# Altium schematic sheet CRYO_ASIC_flex_40pin_adapter.SchDoc
size A3; SheetNumber: 1; SheetTotal: 1
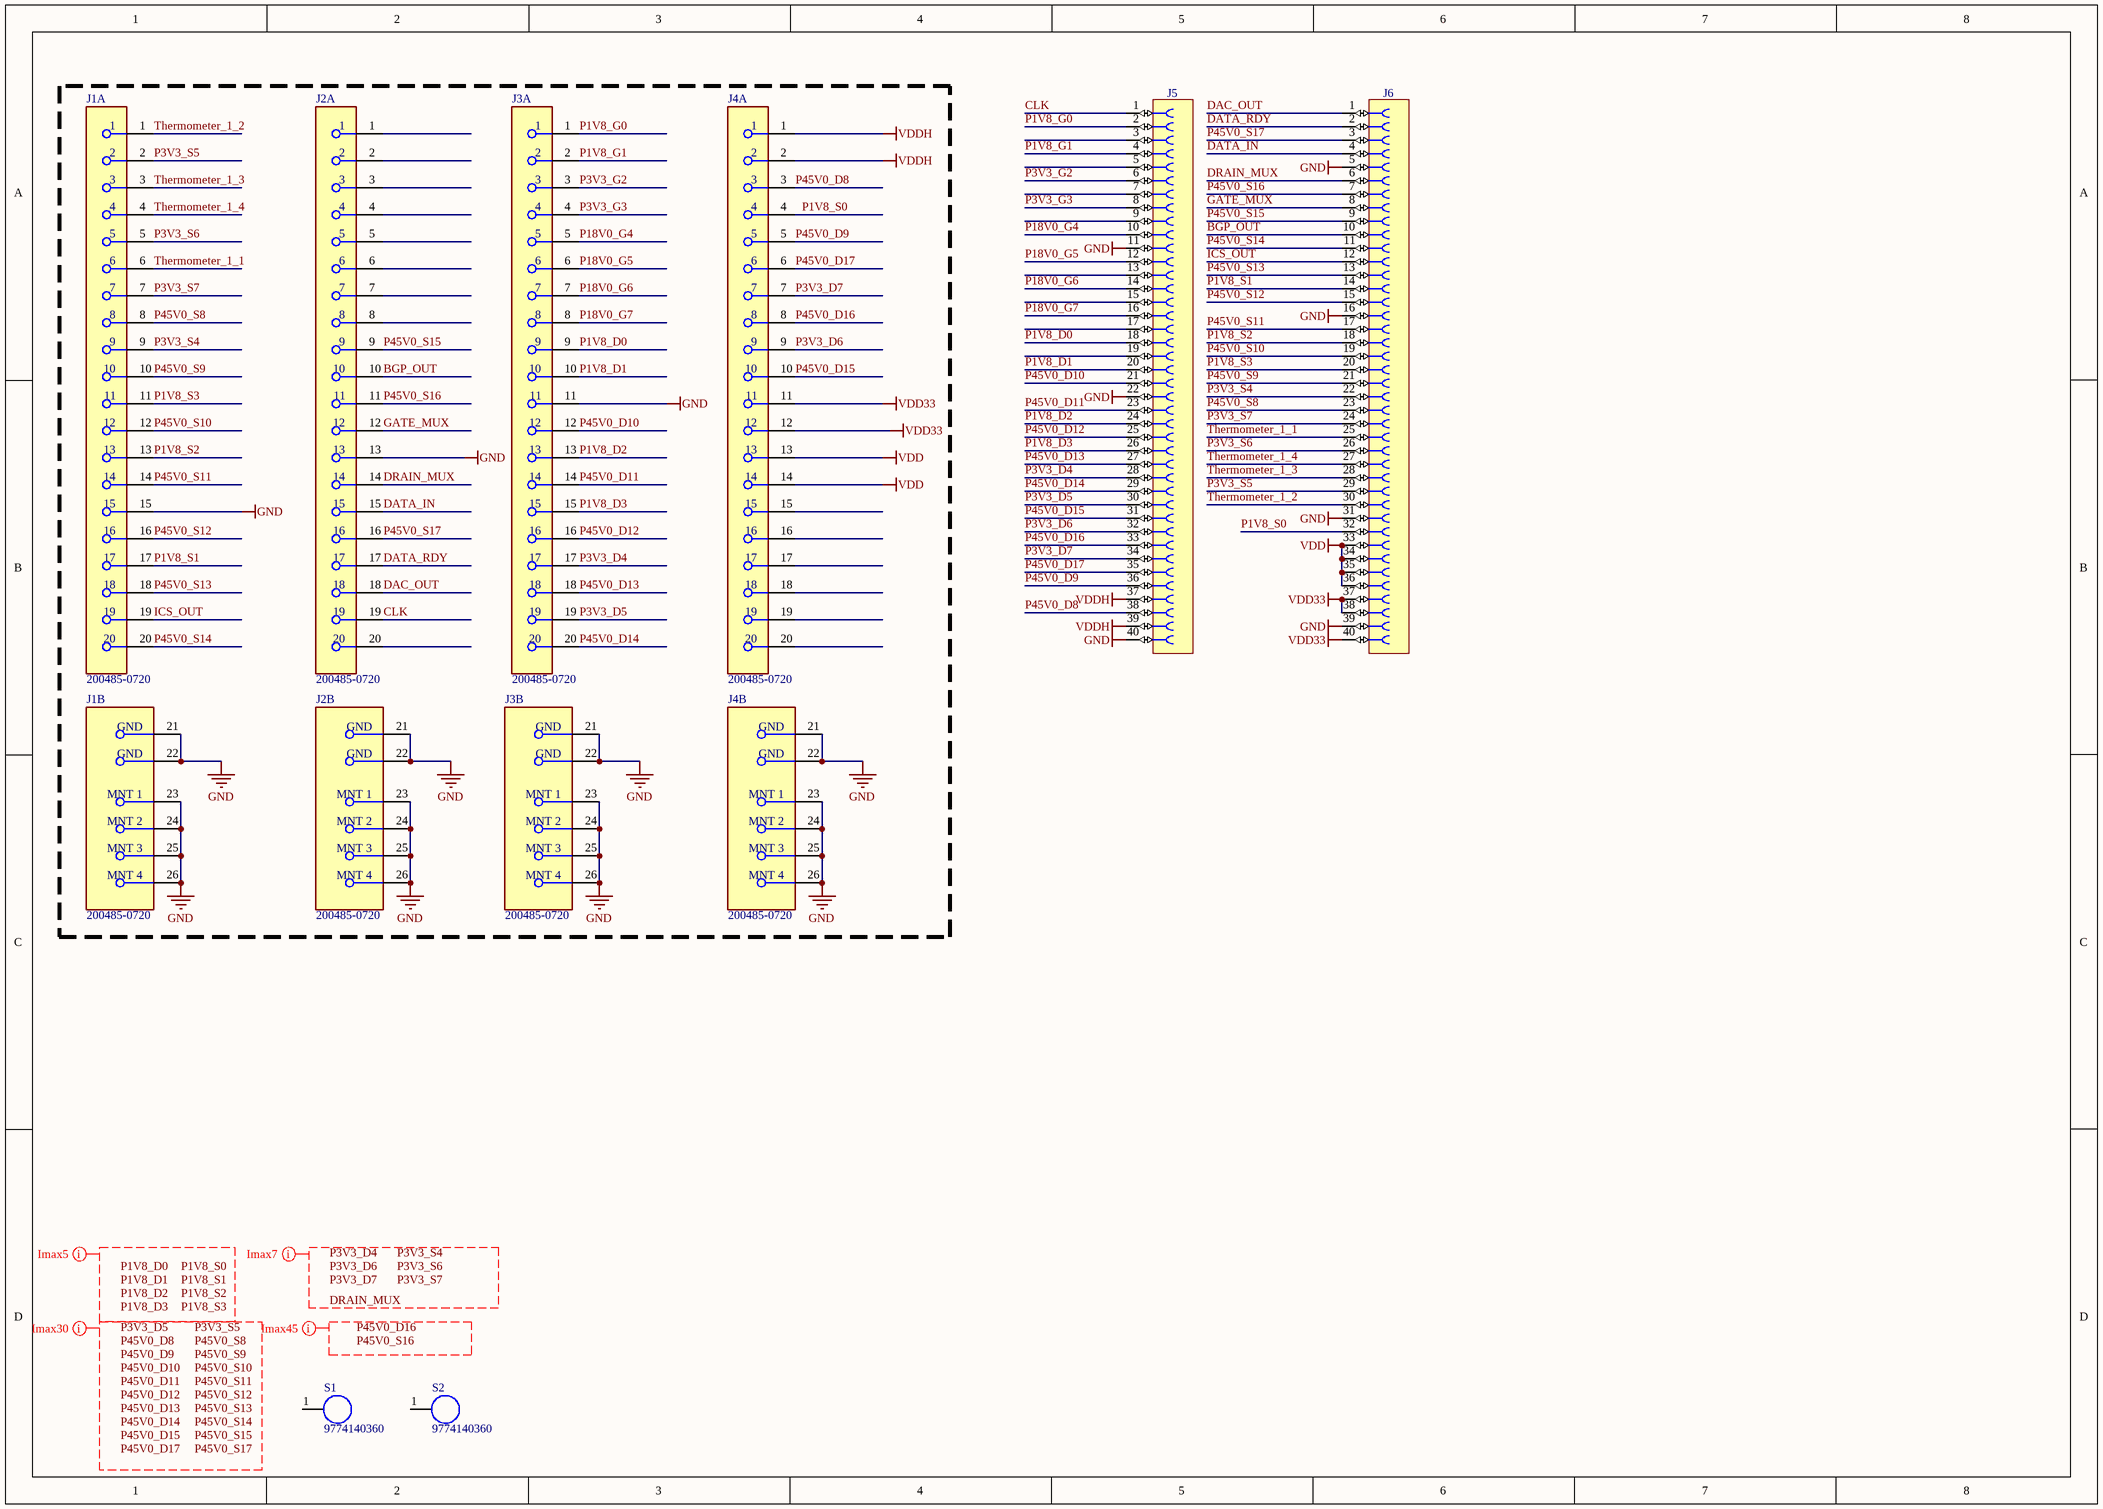
[diagram p0: CRYO_ASIC_flex_40pin_adapter.SchDoc]

## Parts
J1  200485-0720  [FP-200485-0720-MFG]  (parts A,B of 2)
J2  200485-0720  [FP-200485-0720-MFG]  (parts A,B of 2)
J3  200485-0720  [FP-200485-0720-MFG]  (parts A,B of 2)
J4  200485-0720  [FP-200485-0720-MFG]  (parts A,B of 2)
J5  Socket 40  [SAMTEC_RSM-120-02-L-D-K-TR]  (value not drawn)
J6  Socket 40  [SAMTEC_RSM-120-02-L-D-K-TR]  (value not drawn)
S1  9774140360  [9774140360]
S2  9774140360  [9774140360]

## Nets
GND: J1.15 J1.21(GND) J1.22(GND) J1.23(MNT_1) J1.24(MNT_2) J1.25(MNT_3) J1.26(MNT_4) J2.13 J2.21(GND) J2.22(GND) J2.23(MNT_1) J2.24(MNT_2) J2.25(MNT_3) J2.26(MNT_4) J3.11 J3.21(GND) J3.22(GND) J3.23(MNT_1) J3.24(MNT_2) J3.25(MNT_3) J3.26(MNT_4) J4.21(GND) J4.22(GND) J4.23(MNT_1) J4.24(MNT_2) J4.25(MNT_3) J4.26(MNT_4) J5.11 J5.22 J5.40 J6.5 J6.16 J6.31 J6.39
VDD: J4.13 J4.14 J6.33 J6.34 J6.35 J6.36
VDD33: J4.11 J4.12 J6.37 J6.38 J6.40
VDDH: J4.1 J4.2 J5.37 J5.39
BGP_OUT: J2.10 J6.10
CLK: J2.19 J5.1
DAC_OUT: J2.18 J6.1
DATA_IN: J2.15 J6.4
DATA_RDY: J2.17 J6.2
DRAIN_MUX: J2.14 J6.6
GATE_MUX: J2.12 J6.8
ICS_OUT: J1.19 J6.12
P1V8_D0: J3.9 J5.18
P1V8_D1: J3.10 J5.20
P1V8_D2: J3.13 J5.24
P1V8_D3: J3.15 J5.26
P1V8_G0: J3.1 J5.2
P1V8_G1: J3.2 J5.4
P1V8_S0: J4.4 J6.32
P1V8_S1: J1.17 J6.14
P1V8_S2: J1.13 J6.18
P1V8_S3: J1.11 J6.20
P3V3_D4: J3.17 J5.28
P3V3_D5: J3.19 J5.30
P3V3_D6: J4.9 J5.32
P3V3_D7: J4.7 J5.34
P3V3_G2: J3.3 J5.6
P3V3_G3: J3.4 J5.8
P3V3_S4: J1.9 J6.22
P3V3_S5: J1.2 J6.29
P3V3_S6: J1.5 J6.26
P3V3_S7: J1.7 J6.24
P18V0_G4: J3.5 J5.10
P18V0_G5: J3.6 J5.12
P18V0_G6: J3.7 J5.14
P18V0_G7: J3.8 J5.16
P45V0_D8: J4.3 J5.38
P45V0_D9: J4.5 J5.36
P45V0_D10: J3.12 J5.21
P45V0_D11: J3.14 J5.23
P45V0_D12: J3.16 J5.25
P45V0_D13: J3.18 J5.27
P45V0_D14: J3.20 J5.29
P45V0_D15: J4.10 J5.31
P45V0_D16: J4.8 J5.33
P45V0_D17: J4.6 J5.35
P45V0_S8: J1.8 J6.23
P45V0_S9: J1.10 J6.21
P45V0_S10: J1.12 J6.19
P45V0_S11: J1.14 J6.17
P45V0_S12: J1.16 J6.15
P45V0_S13: J1.18 J6.13
P45V0_S14: J1.20 J6.11
P45V0_S15: J2.9 J6.9
P45V0_S16: J2.11 J6.7
P45V0_S17: J2.16 J6.3
Thermometer_1_1: J1.6 J6.25
Thermometer_1_2: J1.1 J6.30
Thermometer_1_3: J1.3 J6.28
Thermometer_1_4: J1.4 J6.27

Not connected (* = marked no-connect by the designer): J2 1 2 3 4 5 6 7 8 20; J4 15 16 17 18 19 20; J5 3 5 7 9 13 15 17 19; S1 1; S2 1

## Layout directives
net class Imax5: P1V8_D0, P1V8_D1, P1V8_D2, P1V8_D3, P1V8_S0, P1V8_S1, P1V8_S2, P1V8_S3
net class Imax7: DRAIN_MUX, P3V3_D4, P3V3_D6, P3V3_D7, P3V3_S4, P3V3_S6, P3V3_S7
net class Imax30: P3V3_D5, P3V3_S5, P45V0_D8, P45V0_D9, P45V0_D10, P45V0_D11, P45V0_D12, P45V0_D13, P45V0_D14, P45V0_D15, P45V0_D17, P45V0_S8, P45V0_S9, P45V0_S10, P45V0_S11, P45V0_S12, P45V0_S13, P45V0_S14, P45V0_S15, P45V0_S17
net class Imax45: P45V0_D16, P45V0_S16

## Notes on the sheet
- Labels drawn without touching a wire or pin: DRAIN_MUX, P1V8_D0, P1V8_D1, P1V8_D2, P1V8_D3, P1V8_S0, P1V8_S1, P1V8_S2, P1V8_S3, P3V3_D4, P3V3_D5, P3V3_D6, P3V3_D7, P3V3_S4, P3V3_S5, P3V3_S6, P3V3_S7, P45V0_D8, P45V0_D9, P45V0_D10, P45V0_D11, P45V0_D12, P45V0_D13, P45V0_D14, P45V0_D15, P45V0_D16, P45V0_D17, P45V0_S8, P45V0_S9, P45V0_S10, P45V0_S11, P45V0_S12, P45V0_S13, P45V0_S14, P45V0_S15, P45V0_S16, P45V0_S17

## Library data of the parts
J1-J4 = CMP-04775-000032-1: 0.5 ONE-TOUCH ST 20P GND
J5 J6 = SAMTEC_RSM-120-02-L-D-K-TR: Connector 40 Female; Part Description: 40 Contacts, Pitch 1.27mm, Dual Row Straight SMD Micro Socket; Manufacturer: SAMTEC; PressFit: No; Part Number: SAMTEC_RSM-120-02-L-D-K-TR; Component Kind: Standard; Component Type: Standard; Pin Count: 40; Family: Socket 40; Mounted: Yes; Socket: No; SMD: Yes; Sense: No; Status: None; Manufacturer Part Number: RSM-120-02-L-D-K; ComponentHeight: 6.1mm; HelpURL: \\cern.ch\dfs\Applications\Altium\Datasheets\SAMTEC_RSM-120-02-L-D-K-TR.pdf; Author: CERN DEM JLC; CreateDate: 09.01.2013; LatestRevisionDate: 09.01.2023; System: Connector
S1 S2 = WA-SMSI,  9774140360: WA-SMSI SMD Steel Spacer with internal Thread; Manufacturer: Wurth Elektronik; partNo: 9774140360; ComponentLink1Description: Manufacturer; ComponentLink1URL: http://www.we-online.de; Created by: Baojun Chen; Created Date: 20.Oct.2015; ComponentLink2Description: Datasheet; ComponentLink2URL: http://katalog.we-online.de/em/datasheet/9774140360.pdf